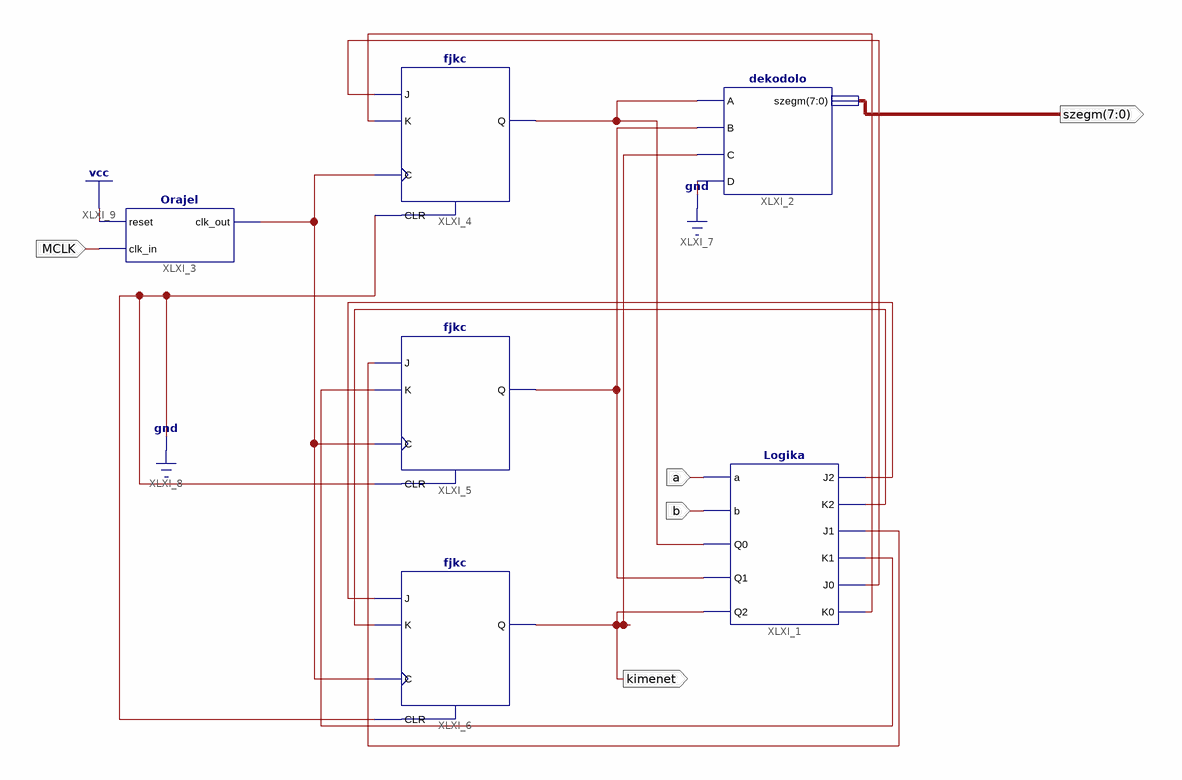
[diagram p0: schematic sheet 1]
// Xilinx ISE schematic frekoszto.sch (spartan3e) as structural Verilog: 6 symbols, 5 ports
module frekoszto (
  input  MCLK,
  input  a,
  input  b,
  output kimenet,
  output [7:0] szegm
);

  wire XLXN_1, XLXN_2, XLXN_9, XLXN_10, XLXN_13, XLXN_14, XLXN_15, XLXN_16, XLXN_22;

  Logika XLXI_1 (
    .a(a), .b(b), .Q0(XLXN_1), .Q1(XLXN_2), .Q2(kimenet), .J2(XLXN_9), .K2(XLXN_10), .J1(XLXN_13),
    .K1(XLXN_14), .J0(XLXN_15), .K0(XLXN_16));
  dekodolo XLXI_2 (.A(XLXN_1), .B(XLXN_2), .C(kimenet), .D(1'b0), .szegm(szegm));
  Orajel XLXI_3 (.reset(1'b1), .clk_in(MCLK), .clk_out(XLXN_22));
  fjkc XLXI_4 (.C(XLXN_22), .CLR(1'b0), .J(XLXN_15), .K(XLXN_16), .Q(XLXN_1));
  fjkc XLXI_5 (.C(XLXN_22), .CLR(1'b0), .J(XLXN_13), .K(XLXN_14), .Q(XLXN_2));
  fjkc XLXI_6 (.C(XLXN_22), .CLR(1'b0), .J(XLXN_9), .K(XLXN_10), .Q(kimenet));
endmodule
